# EAGLE schematic rakete (EAGLE 7.4.0)
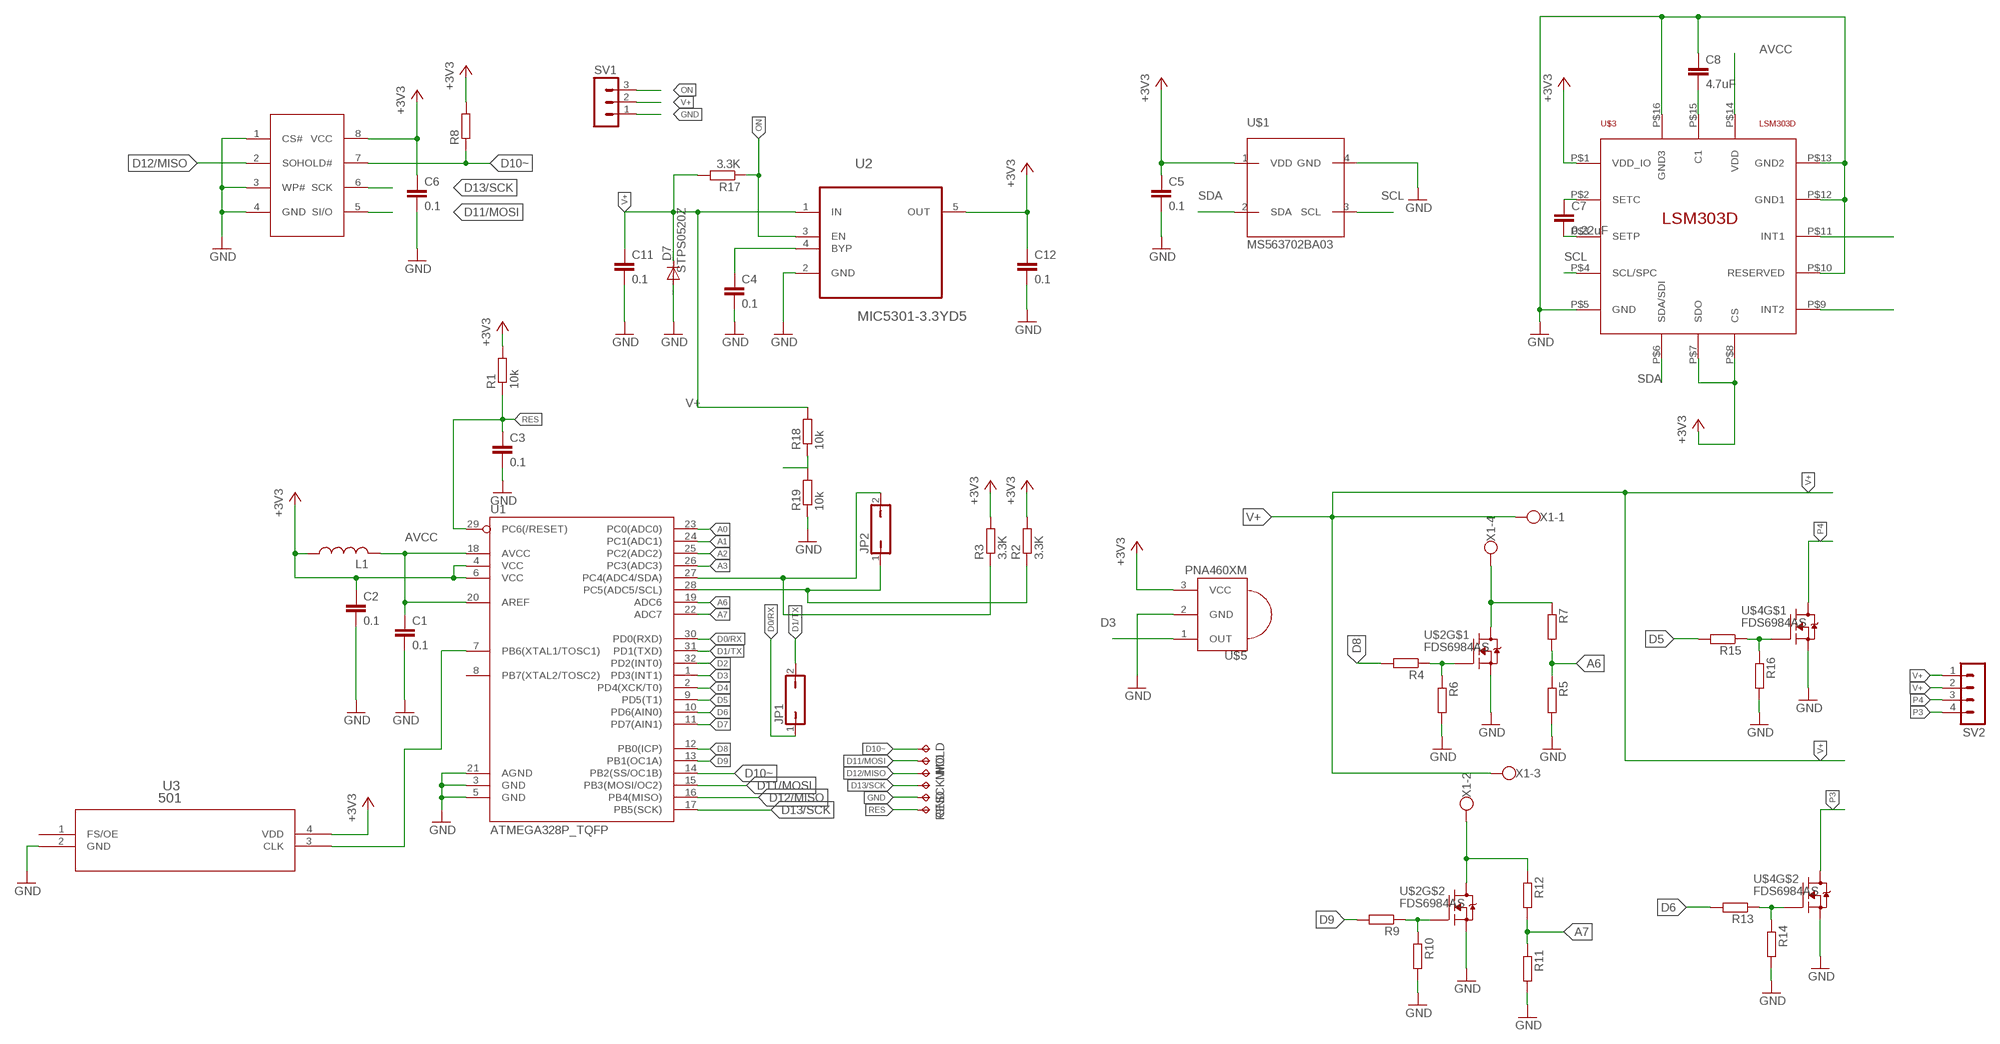
[diagram p0: schematic, sheet 1]

## Parts
C1  0.1  C-EUC0805  [C0805]
C2  0.1  C-EUC0805  [C0805]
C3  0.1  C-EUC0805  [C0805]
C4  0.1  C-EUC0805  [C0805]
C5  0.1  C-EUC0805  [C0805]
C6  0.1  C-EUC0805  [C0805]
C7  0.22uF  C-EUC0603  [C0603]
C8  4.7uF  C-EUC0603  [C0603]
C11  0.1  C-EUC0805  [C0805]
C12  0.1  C-EUC0805  [C0805]
D7  CGRM4001-G  [SOD-123_MINI-SMA]
GND  TPB2,54  [B2,54]
HOLD  TPB2,54  [B2,54]
JP1  JP1Q  [JP1]
JP2  JP1Q  [JP1]
L1  L-USL2012C  [L2012C]
MI  TPB2,54  [B2,54]
MO  TPB2,54  [B2,54]
R1  10k  R-EU_R0805  [R0805]
R2  3.3K  R-EU_R0805  [R0805]
R3  3.3K  R-EU_R0805  [R0805]
R4  R-EU_R0805  [R0805]
R5  R-EU_R0805  [R0805]
R6  R-EU_R0805  [R0805]
R7  R-EU_R0805  [R0805]
R8  R-EU_R0805  [R0805]
R9  R-EU_R0805  [R0805]
R10  R-EU_R0805  [R0805]
R11  R-EU_R0805  [R0805]
R12  R-EU_R0805  [R0805]
R13  R-EU_R0805  [R0805]
R14  R-EU_R0805  [R0805]
R15  R-EU_R0805  [R0805]
R16  R-EU_R0805  [R0805]
R17  3.3K  R-EU_R0805  [R0805]
R18  10k  R-EU_R0805  [R0805]
R19  10k  R-EU_R0805  [R0805]
RE  TPB2,54  [B2,54]
SCK  TPB2,54  [B2,54]
SV1  MA03-1  [MA03-1]
SV2  MA04-1  [MA04-1]
U1  ATMEGA328P_TQFP  [TQFP32-08]
U2  MIC5301-3.3YD5  MIC5205-3.3YM5TR  [SOT95P280X130-5N]
U3  501  [SI501_4_2X2.5]
U$1  MS563702BA03  [MS5637]
U$2  FDS6984AS  [SO8]
U$3  LSM303D  [TFLGA16L]
U$4  FDS6984AS  [SO8]
U$5  PNA460XM  [PNA460XM]
U$6  25FL208K0RMFI041  [SO08]
X1  W237-4  [W237-4]

## Nets
+3V3: C2.1 C5.1 C6.1 C12.1 L1.1 R1.2 R2.2 R3.2 R8.2 U1.4(VCC) U1.6(VCC) U2.5(OUT) U3.4(VDD) U$1.1(VDD) U$3.P$1(VDD_IO) U$3.P$7(SDO) U$3.P$8(CS) U$5.3(VCC) U$6.8(VCC)
A0: U1.23(PC0(ADC0))
A1: R18.1 R19.2 U1.24(PC1(ADC1))
A2: U1.25(PC2(ADC2))
A3: U1.26(PC3(ADC3))
A6: R5.1 R7.2 U1.19(ADC6)
A7: R11.1 R12.2 U1.22(ADC7)
AVCC: C1.1 L1.2 U1.18(AVCC) U1.20(AREF) U$3.P$14(VDD)
D0/RX: JP1.1 U1.30(PD0(RXD))
D1/TX: JP1.2 U1.31(PD1(TXD))
D2: U1.32(PD2(INT0))
D3: U1.1(PD3(INT1)) U$5.1(OUT)
D4: U1.2(PD4(XCK/T0))
D5: R15.2 U1.9(PD5(T1))
D6: R13.2 U1.10(PD6(AIN0))
D7: U1.11(PD7(AIN1))
D8: R4.2 U1.12(PB0(ICP))
D9: R9.2 U1.13(PB1(OC1A))
D10~: HOLD.TP R8.1 U1.14(PB2(SS/OC1B)) U$6.7(HOLD#)
D11/MOSI: MO.TP U1.15(PB3(MOSI/OC2)) U$6.5(SI/O)
D12/MISO: MI.TP U1.16(PB4(MISO)) U$6.2(SO)
D13/SCK: SCK.TP U1.17(PB5(SCK)) U$6.6(SCK)
GND: C1.2 C2.2 C3.2 C4.2 C5.2 C6.2 C8.1 C11.2 C12.2 D7.A GND.TP R5.2 R6.2 R10.2 R11.2 R14.2 R16.2 R19.1 SV1.1 U1.3(GND) U1.5(GND) U1.21(AGND) U2.2(GND) U3.2(GND) U$1.4(GND) U$2.1(S) U$2.3(S) U$3.P$5(GND) U$3.P$10(RESERVED) U$3.P$12(GND1) U$3.P$13(GND2) U$3.P$16(GND3) U$4.1(S) U$4.3(S) U$5.2(GND) U$6.1(CS#) U$6.3(WP#) U$6.4(GND)
GYROINT1: U$3.P$11(INT1)
GYROINT2: U$3.P$9(INT2)
N$10: U1.7(PB6(XTAL1/TOSC1)) U3.3(CLK)
N$13: R4.1 R6.1 U$2.4(G)
N$18: R7.1 U$2.5(D) U$2.6(D) X1.4
N$21: C7.1 U$3.P$2(SETC)
N$25: C7.2 U$3.P$3(SETP)
N$27: C8.2 U$3.P$15(C1)
N$29: R9.1 R10.1 U$2.2(G)
N$30: R12.1 U$2.7(D) U$2.8(D) X1.2
N$31: C4.1 U2.4(BYP)
N$33: R13.1 R14.1 U$4.2(G)
N$41: R15.1 R16.1 U$4.4(G)
ON: R17.1 SV1.3 U2.3(EN)
P3: SV2.4 U$4.7(D) U$4.8(D)
P4: SV2.3 U$4.5(D) U$4.6(D)
RES: C3.1 R1.1 RE.TP U1.29(PC6(/RESET))
SCL: JP2.1 R2.1 U1.28(PC5(ADC5/SCL)) U$1.3(SCL) U$3.P$4(SCL/SPC)
SDA: JP2.2 R3.1 U1.27(PC4(ADC4/SDA)) U$1.2(SDA) U$3.P$6(SDA/SDI)
V+: C11.1 D7.C R17.2 R18.2 SV1.2 SV2.1 SV2.2 U2.1(IN) X1.1 X1.3
Unconnected: U1.8(PB7(XTAL2/TOSC2)) U3.1(FS/OE)

## Library data of the parts
C1-C6 C11 C12 = resistor:C-EU: CAPACITOR, European symbol
C7 C8 = rcl:C-EU: CAPACITOR, European symbol
D7 = diode:CGRM400*-G: Molded plasitc,JEDEC SOD-123/Mini SMA Source: Comchip CGRM4001-G.pdf; FARNELL: 1467545; LINK: http://lv.farnell.com/stmicroelectronics/stps0520z/diode-schottky-2a-20v-smd/dp/1467545; MFGNAME: STPS0520Z
GND HOLD MI MO RE SCK = testpad:TP: Test pad
JP1 JP2 = jumper:JP1Q: JUMPER
L1 = resistor:L-US: INDUCTOR, American symbol
R1-R19 = resistor:R-EU_: RESISTOR, European symbol
SV1 = con-lstb:MA03-1: PIN HEADER; OC_FARNELL: unknown; OC_NEWARK: unknown
SV2 = con-lstb:MA04-1: PIN HEADER; OC_FARNELL: unknown; OC_NEWARK: unknown
U1 = SparkFun-DigitalIC:ATMEGA328P_TQFP; PROD_ID: IC-09069
U2 = Micrel_By_element14_Batch_1:MIC5205-3.3YM5TR: 150mA Low-Noise LDO Regulator; MPN: MIC5301-3.3YD5; OC_FARNELL: 2431779; PACKAGE: SOT-23-5; SUPPLIER: MICREL SEMICONDUCTOR; URL: http://lv.farnell.com/micrel-semiconductor/mic5301-3-3yd5-tr/ldo-volt-reg-0-15a-3-3v-tsot-23/dp/2431779
U3 = SiLabs2025:501; MANUFACTURER_PART_NUMBER: 501; VENDOR: SILICONLABS
U$1 = freetronics-original:MS5637
U$2 U$4 = FDS6984AS:FDS6984AS; FARNELL: 2454158; MFG: FDS6984AS; URL: http://lv.farnell.com/fairchild-semiconductor/fds6984as/mosfet-dual-n-ch-30v-8-5a-soic/dp/2454158
U$3 = LSM303D:LSM303D
U$5 = adafruit:PNA460XM: IR 38KHz receiver PNA4602 and related receivers http://www.ladyada.net/library/pcb/eaglelibrary.html
U$6 = MEMORY-8PIN:25FL208K0RMFI041
X1 = con-wago-500:W237-4: WAGO SCREW CLAMP; OC_FARNELL: unknown; OC_NEWARK: unknown